# Altium schematic sheet CY8C4125AZI-S433.SchDoc: CY8C4125AZI-S433
size A3
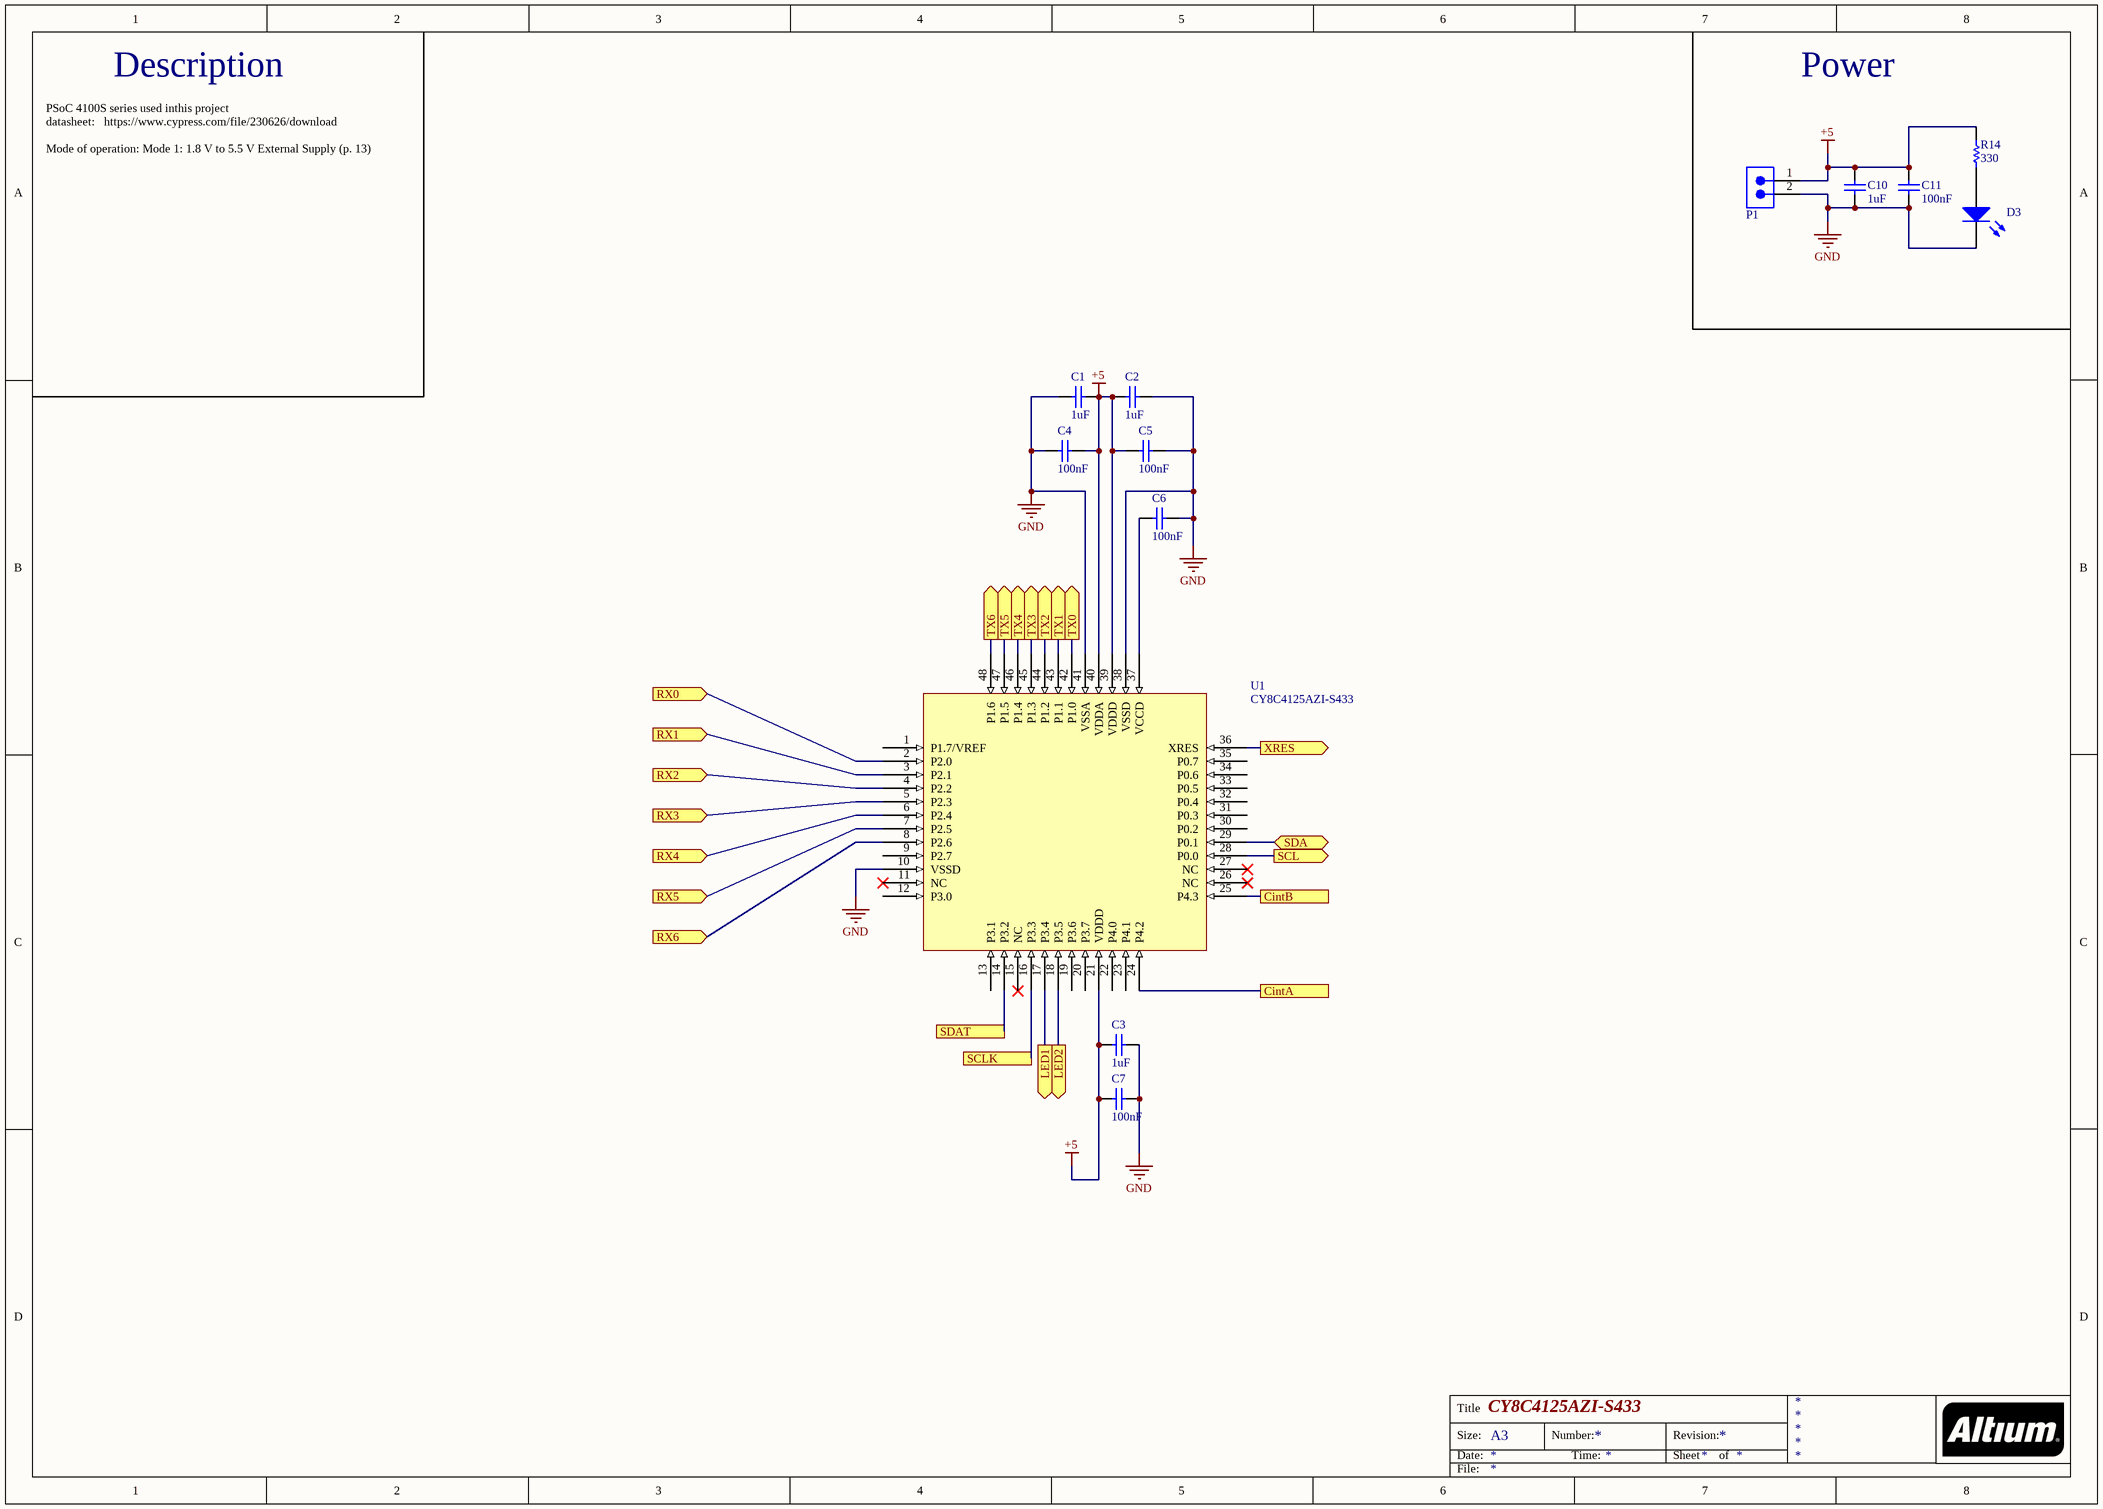
[diagram p0: CY8C4125AZI-S433.SchDoc]

## Parts
C1  1uF  [CAPC0603(1608)100_N]
C2  1uF  [CAPC0603(1608)100_N]
C3  1uF  [CAPC0603(1608)100_N]
C4  100nF  [CAPC1608X90X20LL10]
C5  100nF  [CAPC1608X90X20LL10]
C6  100nF  [CAPC1608X90X20LL10]
C7  100nF  [CAPC1608X90X20LL10]
C10  1uF  [CAPC0603(1608)100_N]
C11  100nF  [CAPC1608X90X20LL10]
D3  150060BS75000  [0603_A]  (value not drawn)
P1  MTLW-102-05-T-S-172  [SMTC-MTLW-102-05-X-S-172]  (value not drawn)
R14  330  [RESC0603(1608)_L]
U1  CY8C4125AZI-S433  [CY8C4125AZI-S433]

## Ports
CintA, CintB, LED1 (out), LED2 (out), RX0 (in), RX1 (in), RX2 (in), RX3 (in), RX4 (in), RX5 (in), RX6 (in), SCL (out), SCLK, SDA (bidir), SDAT, TX0 (out), TX1 (out), TX2 (out), TX3 (out), TX4 (out), TX5 (out), TX6 (out), XRES (out)

## Nets
+5: C1.2 C2.1 C3.1 C4.2 C5.1 C7.1 C10.2 C11.2 P1.1 R14.1 U1.21(VDDD) U1.39(VDDD) U1.40(VDDA)
GND: C1.1 C2.2 C3.2 C4.1 C5.2 C6.2 C7.2 C10.1 C11.1 D3.1(K) P1.2 U1.10(VSSD) U1.38(VSSD) U1.41(VSSA)
CintA: U1.24(P4.2) ; port CintA
CintB: U1.25(P4.3) ; port CintB
LED1: U1.17(P3.4) ; port LED1
LED2: U1.18(P3.5) ; port LED2
RX0: U1.2(P2.0) ; port RX0
RX1: U1.3(P2.1) ; port RX1
RX2: U1.4(P2.2) ; port RX2
RX3: U1.5(P2.3) ; port RX3
RX4: U1.6(P2.4) ; port RX4
RX5: U1.7(P2.5) ; port RX5
RX6: U1.8(P2.6) ; port RX6
SCL: U1.28(P0.0) ; port SCL
SCLK: U1.16(P3.3) ; port SCLK
SDA: U1.29(P0.1) ; port SDA
SDAT: U1.14(P3.2) ; port SDAT
TX0: U1.42(P1.0) ; port TX0
TX1: U1.43(P1.1) ; port TX1
TX2: U1.44(P1.2) ; port TX2
TX3: U1.45(P1.3) ; port TX3
TX4: U1.46(P1.4) ; port TX4
TX5: U1.47(P1.5) ; port TX5
TX6: U1.48(P1.6) ; port TX6
XRES: U1.36(XRES) ; port XRES
NetC6_1: C6.1 U1.37(VCCD)
NetD3_2: D3.2(A) R14.2

Not connected (* = marked no-connect by the designer): U1 1(P1.7/VREF) 9(P2.7) 11(NC)* 12(P3.0) 13(P3.1) 15(NC)* 19(P3.6) 20(P3.7) 22(P4.0) 23(P4.1) 26(NC)* 27(NC)* 30(P0.2) 31(P0.3) 32(P0.4) 33(P0.5) 34(P0.6) 35(P0.7)

## Notes on the sheet
- Description
- Power
- PSoC 4100S series used inthis project
  datasheet:   https://www.cypress.com/file/230626/download
  Mode of operation: Mode 1: 1.8 V to 5.5 V External Supply (p. 13)
- Title
- Size:
- Date:
- A3
- Number:
- Time:
- Revision:
- Sheet
- of
- File:

## Library data of the parts
C1-C3 C10 = CMP-1035-02746-1: CAP 1uF 50V ±20% 0603 (1608 Metric) Thickness 1mm SMD; Tolerance: Â±20%; Case-EIA: 0603; Case-Metric: 1608; Value: 1uF; Technology: SMT; Max Thickness: 1 mm; Rated Voltage: 50 V
C4-C7 C11 = CMP-2000-07546-1: CGA3E2X7R1H104K080AA Chip Capacitor, 0.1 uF, +/- 10%, 50 V, -55 to 125 degC, 0603 (1608 Metric), RoHS, Tape and Reel; Manufacturer: TDK; Voltage: 50V; Dielectric: X7R; Package Reference: 603; Radiation Hardening: No; Composition: Ceramic; Datasheet URL: https://product.tdk.com/info/en/catalog/datasheets/mlcc_automotive_general_en.pdf; Mounting Technology: SurfaceMount; Datasheet Version: 12/2014; Width: 0.8mm; Length: 1.6mm; Capacitance: 100nF; Tolerance: 10%; Case Code (Imperial): 0603; RoHSCompliant: True; Min Operating Temperature: -55degC; Package Description: 2-Pin Surface Mount Device, Body 1.6 x 0.8 mm; Packaging: TapeandReel; Package Quantity: 1; Voltage Rating: 50V; Mount: SurfaceMount; Lead Free: LeadFree; Depth: 0.8mm; Termination: SMD/SMT; Case Code (Metric): 1608; Thickness: 0.035inch; Height: 0.8mm; Weight: 7.1E-05oz; Voltage Rating (DC): 50V; REACH SVHC: NoSVHC; Manufacturer URL: http://www.tdk.com/; Case/Package: 0603; Max Operating Temperature: 125degC
D3 = CMP-1426-00003-1: SMD mono-color Chip LED, WL-SMCW, Blue; Manufacturer: Wuerth Elektronik; Color: Blue; ComponentLink2Description: Datasheet; ComponentLink2URL: http://katalog.we-online.com/led/datasheet/150060BS75000.pdf; ComponentLink1URL: http://www.we-online.com; PackageReference: 0603_A; PartNumber: 150060BS75000; ComponentLink1Description: Manufacturer URL
P1 = CMP-1024-00065-1: Low Profile .025" SQ Post Header, Through-hole, Vertical, -55 to 105 degC, 2.54 mm Pitch, 2-Pin, Male, RoHS; Manufacturer: Samtec; Pitch: 2.54 mm; ComponentLink2URL: http://www.samtec.com/documents/webfiles/pdf/MTLW_TH.PDF; PackageReference: MTLW-102-05-X-S-172; Mounting Technology: Through-hole; DatasheetVersion: F-214; Temperature Range: -55 to 105 degC; ComponentLink2Description: Datasheet; Orientation: Vertical; ComponentLink3Description: Package Specification; RoHS: True; PackageDescription: Low Profile Terminal Assembly; ComponentLink3URL: http://www.samtec.com/documents/webfiles/cpdf/MTLW-1XX-XX-XX-X-XXX-XX-XX-MKT1.pdf; ComponentLink1Description: Manufacturer URL; PartNumber: MTLW-102-05-T-S-172; PackageVersion: T, 6/1991; ComponentLink1URL: http://www.samtec.com
R14 = CMP-1012-00062-1: 330R 0.1W 5% 0603 (1608 Metric)  SMD; Value: 330.00 Ohm; Case-EIA: 0603; Case-Metric: 1608; Tolerance: 5 %; Power: 0.1 W; Technology: SMT